# EAGLE design 23128Adapter_v1.0 (EAGLE 7.6.0)
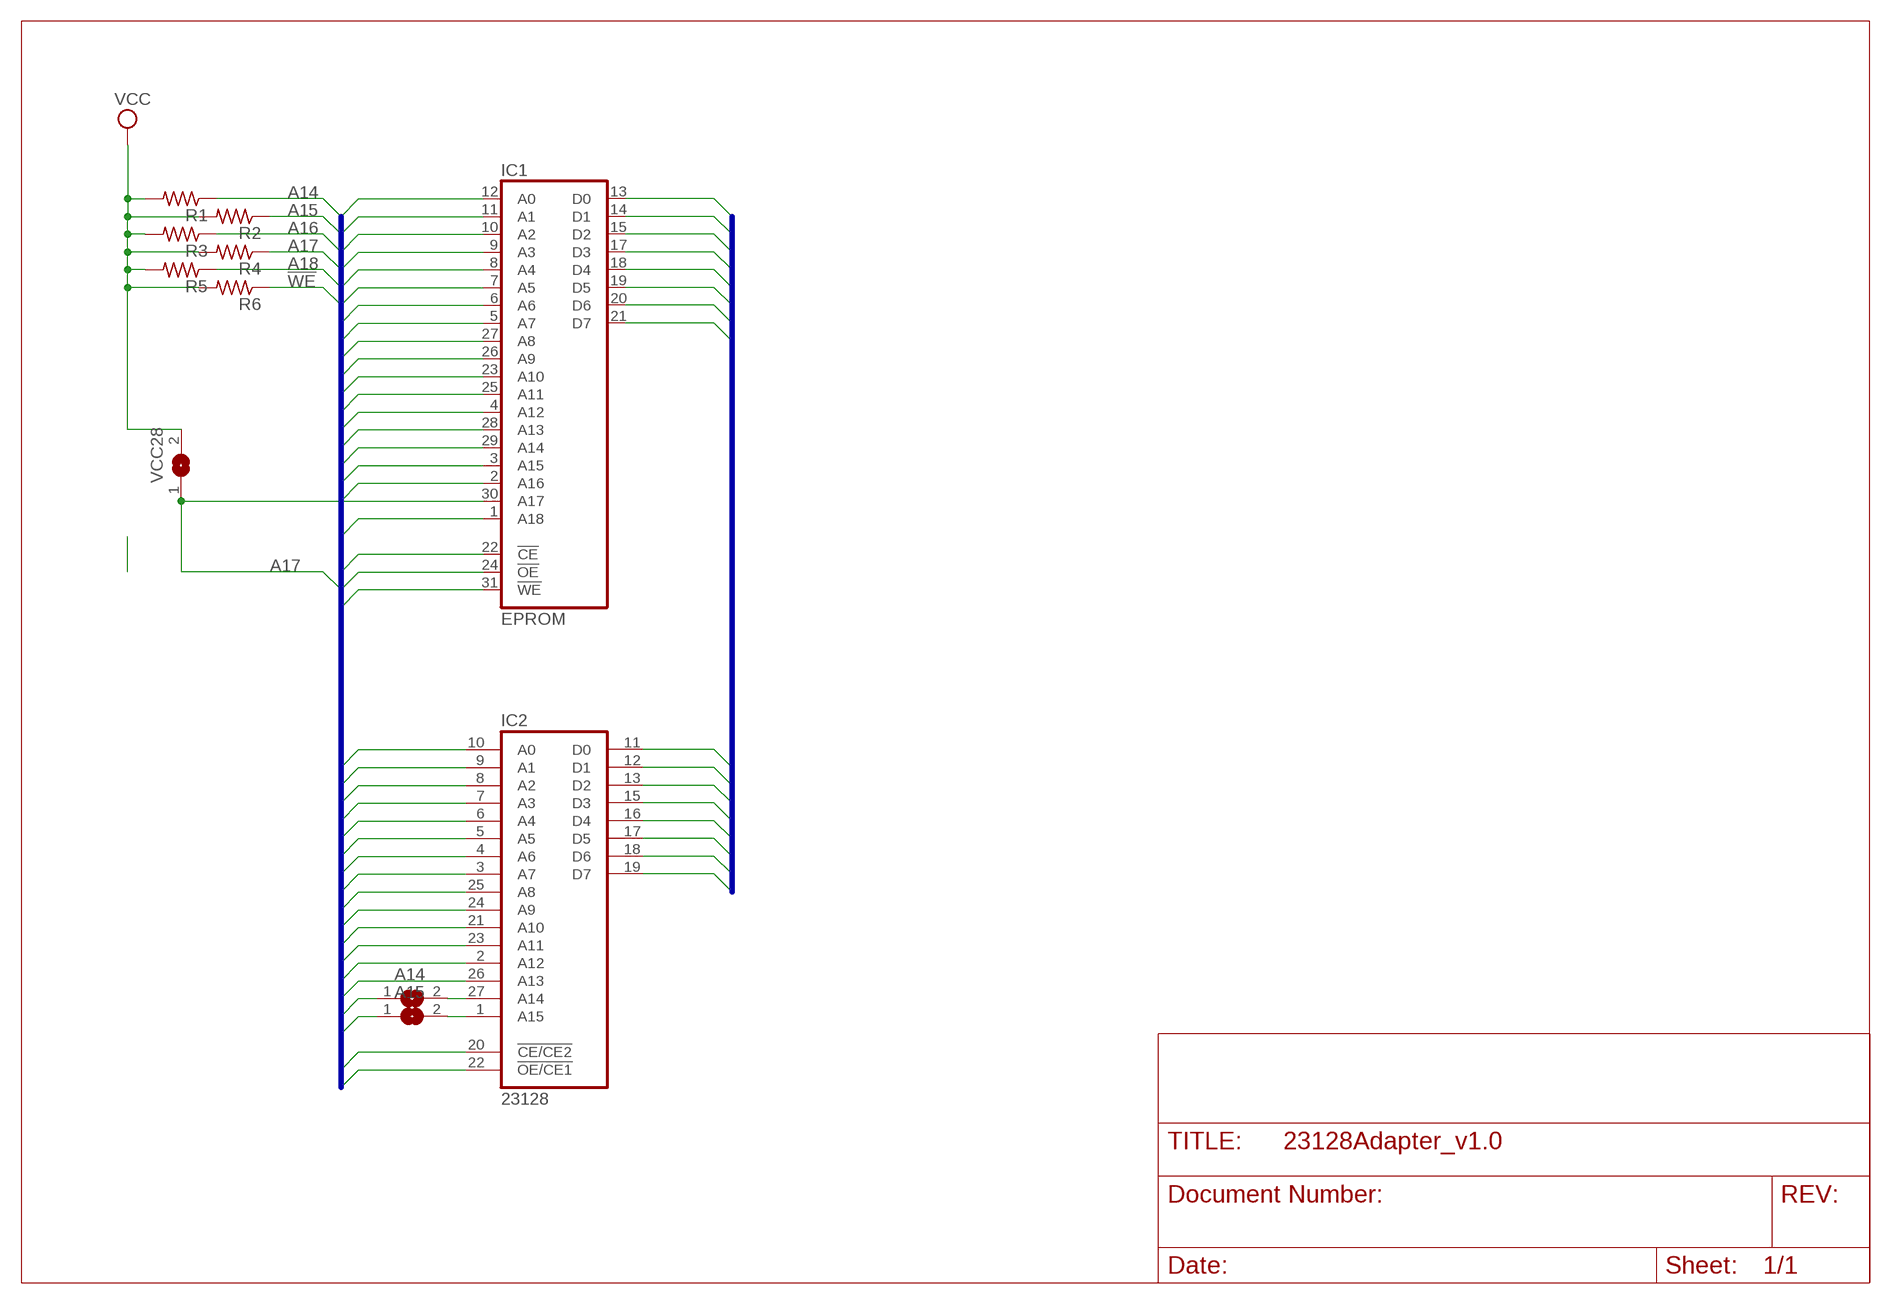
[diagram p0: schematic, sheet 1]

## Parts
A14  SJ  [SJ]
A15  SJ  [SJ]
IC1  EPROM  AM29F040RP  [DIL32-6ROUNDPAD]
IC2  23128  23512-RP  [DIL28-ROUNDPAD]
R1  R-US_0204/5  [0204/5]
R2  R-US_0204/5  [0204/5]
R3  R-US_0204/5  [0204/5]
R4  R-US_0204/5  [0204/5]
R5  R-US_0204/5  [0204/5]
R6  R-US_0204/5  [0204/5]
VCC28  SJ  [SJ]

## Nets
!CE: IC1.22(!CE) IC2.20(!CE/CE2)
!OE: IC1.24(!OE) IC2.22(!OE/CE1)
!WE: IC1.31(!WE) R6.1
A0: IC1.12(A0) IC2.10(A0)
A1: IC1.11(A1) IC2.9(A1)
A2: IC1.10(A2) IC2.8(A2)
A3: IC1.9(A3) IC2.7(A3)
A4: IC1.8(A4) IC2.6(A4)
A5: IC1.7(A5) IC2.5(A5)
A6: IC1.6(A6) IC2.4(A6)
A7: IC1.5(A7) IC2.3(A7)
A8: IC1.27(A8) IC2.25(A8)
A9: IC1.26(A9) IC2.24(A9)
A10: IC1.23(A10) IC2.21(A10)
A11: IC1.25(A11) IC2.23(A11)
A12: IC1.4(A12) IC2.2(A12)
A13: IC1.28(A13) IC2.26(A13)
A14: A14.1 IC1.29(A14) R1.1
A15: A15.1 IC1.3(A15) R2.1
A16: IC1.2(A16) R3.1
A17: IC1.30(A17) R4.1 VCC28.1
A18: IC1.1(A18) R5.1
D0: IC1.13(D0) IC2.11(D0)
D1: IC1.14(D1) IC2.12(D1)
D2: IC1.15(D2) IC2.13(D2)
D3: IC1.17(D3) IC2.15(D3)
D4: IC1.18(D4) IC2.16(D4)
D5: IC1.19(D5) IC2.17(D5)
D6: IC1.20(D6) IC2.18(D6)
D7: IC1.21(D7) IC2.19(D7)
N$1: A14.2 IC2.27(A14)
N$2: A15.2 IC2.1(A15)
VCC: R1.2 R2.2 R3.2 R4.2 R5.2 R6.2 VCC28.2

## Buses
A[0..18],!WE,!OE,!CE
D[0..7]

## Power pins joined to a net without a drawn wire
GND: IC1.16(GND) IC2.14(GND)
VCC: IC1.32(VCC) IC2.28(VCC)

## Library data of the parts
A14 A15 VCC28 = jumper:SJ: SMD solder JUMPER
IC1 = 0RB_Memory:AM29F040: 4-Megabit FLASH MEMORY (512 K x 8 bit) 5 V-only
IC2 = commodore:23512: MEMORY
R1-R6 = resistor:R-US_: RESISTOR, American symbol

## Board
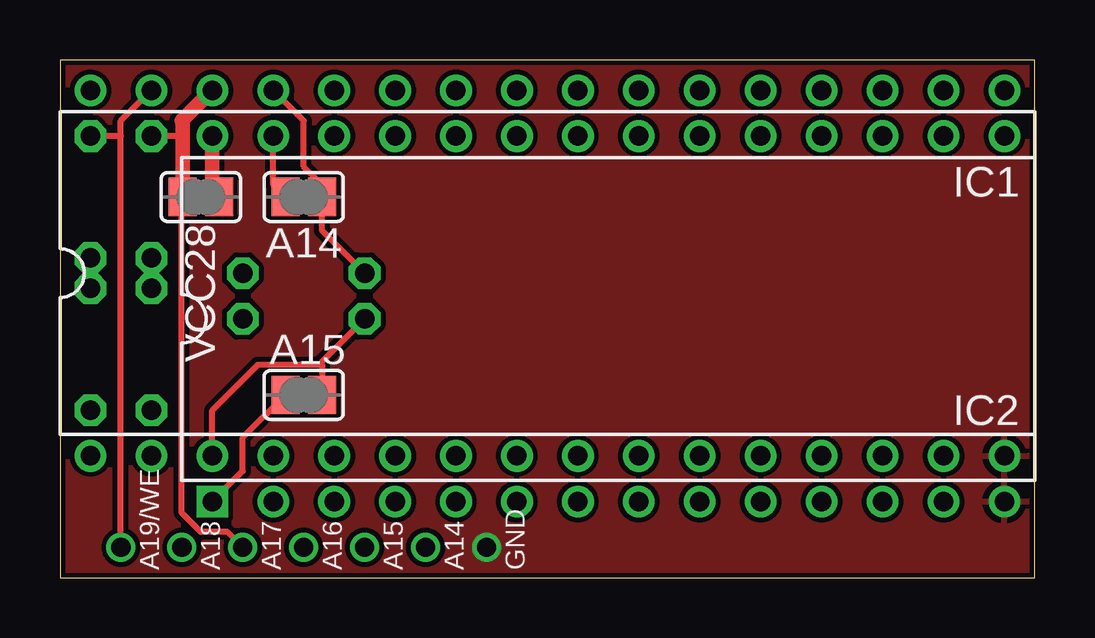
[diagram p1: board, top side]
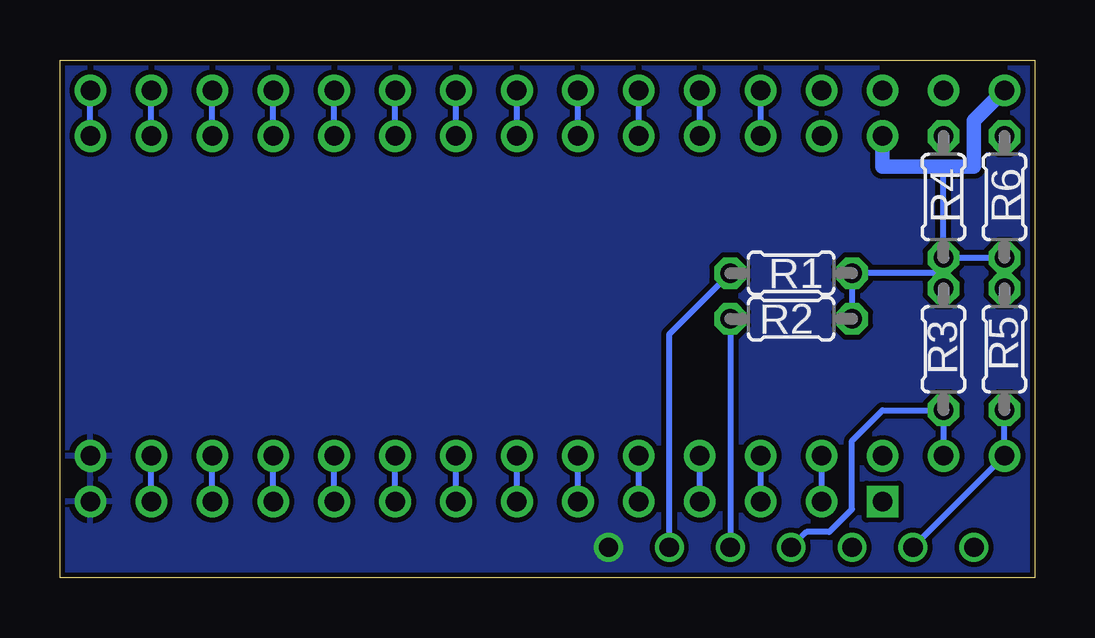
[diagram p2: board, bottom side, seen from below]

Size 40.64 x 21.59 mm. Coordinates in mm from the lower left corner, seen from the top.
Outline: 40.64,0 40.64,21.59 0,21.59 0.01,0 40.64,0
Copper layers (1*16): Top 0.035mm / dielectric 1.5mm / Bottom 0.035mm
Design rules "default *": minimum track width 10mil, minimum drill 24mil, track to track 8mil, track to pad 8mil, pad to pad 8mil, via to via 8mil, smd to smd 8mil, copper to edge 8mil, drill to drill 8mil, minimum pad ring 10mil, minimum via ring 8mil, stop-mask expansion 4mil, vias tented up to drill 0mil, thermal gap 10mil

### Footprints (pad centres in the part's own frame; a part is rotated, then mirrored left to right if it is on the bottom)
SJ = smd 1.168 x 1.6: 1 -0.762,0; 2 0.762,0
DIL32-6ROUNDPAD = drill 0.813: 1 -19.05,-7.62; 2 -16.51,-7.62; 3 -13.97,-7.62; 4 -11.43,-7.62; 5 -8.89,-7.62; 6 -6.35,-7.62; 7 -3.81,-7.62; 8 -1.27,-7.62; 9 1.27,-7.62; 10 3.81,-7.62; 11 6.35,-7.62; 12 8.89,-7.62; 13 11.43,-7.62; 14 13.97,-7.62; 15 16.51,-7.62; 16 19.05,-7.62; 17 19.05,7.62; 18 16.51,7.62; 19 13.97,7.62; 20 11.43,7.62; 21 8.89,7.62; 22 6.35,7.62; 23 3.81,7.62; 24 1.27,7.62; 25 -1.27,7.62; 26 -3.81,7.62; 27 -6.35,7.62; 28 -8.89,7.62; 29 -11.43,7.62; 30 -13.97,7.62; 31 -16.51,7.62; 32 -19.05,7.62
DIL28-ROUNDPAD = drill 0.813 square: 1 -16.51,-7.62 | drill 0.813: 2 -13.97,-7.62; 3 -11.43,-7.62; 4 -8.89,-7.62; 5 -6.35,-7.62; 6 -3.81,-7.62; 7 -1.27,-7.62; 8 1.27,-7.62; 9 3.81,-7.62; 10 6.35,-7.62; 11 8.89,-7.62; 12 11.43,-7.62; 13 13.97,-7.62; 14 16.51,-7.62; 15 16.51,7.62; 16 13.97,7.62; 17 11.43,7.62; 18 8.89,7.62; 19 6.35,7.62; 20 3.81,7.62; 21 1.27,7.62; 22 -1.27,7.62; 23 -3.81,7.62; 24 -6.35,7.62; 25 -8.89,7.62; 26 -11.43,7.62; 27 -13.97,7.62; 28 -16.51,7.62
0204/5 = drill 0.813 octagon: 1 -2.54,0; 2 2.54,0

### Placement (x,y rotation side)
A14  10.16,15.88 180 top
A15  10.16,7.62 180 top
IC1  20.32,12.7 0 top
IC2  22.86,10.79 0 top
R1  10.16,12.7 0 bottom
R2  10.16,10.79 0 bottom
R3  3.81,9.53 90 bottom
R4  3.81,15.88 270 bottom
R5  1.27,9.53 90 bottom
R6  1.27,15.88 270 bottom
VCC28  5.87,15.88 0 top

### Tracks (layer width: path | path; a pad name or v marks a point on that pad's centre or on a via)
!CE
  Bottom 0.254: IC2.20 IC1.22
!OE
  Bottom 0.254: IC2.22 IC1.24
!WE  (via drill 0.8)
  Top 0.254: IC1.31 2.54,19.05 2.54,18.41 | v2.54,1.27 2.54,18.41 | 2.54,18.41 R6.1
A0
  Bottom 0.254: IC2.10 IC1.12
A1
  Bottom 0.254: IC2.9 IC1.11
A2
  Bottom 0.254: IC2.8 IC1.10
A3
  Bottom 0.254: IC2.7 IC1.9
A4
  Bottom 0.254: IC2.6 IC1.8
A5
  Bottom 0.254: IC2.5 IC1.7
A6
  Bottom 0.254: IC2.4 IC1.6
A7
  Bottom 0.254: IC2.3 IC1.5
A8
  Bottom 0.254: IC2.25 IC1.27
A9
  Bottom 0.254: IC2.24 IC1.26
A10
  Bottom 0.254: IC2.21 IC1.23
A11
  Bottom 0.254: IC2.23 IC1.25
A12
  Bottom 0.254: IC2.2 IC1.4
A13
  Bottom 0.254: IC2.26 IC1.28
A14  (via drill 0.8)
  Top 0.254: IC1.29 10.16,19.05 10.16,17.14 10.8,16.51 10.8,16 A14.1 10.92,14.48 R1.1
  Bottom 0.254: v15.24,1.27 15.24,10.16 R1.1
A15  (via drill 0.8)
  Top 0.254: R2.1 10.92,9.02 10.92,8.89 | 10.92,8.89 A15.1 | IC1.3 6.35,6.99 8.26,8.89 10.92,8.89
  Bottom 0.254: R2.1 v12.7,1.27
A16  (via drill 0.8)
  Bottom 0.254: IC1.2 R3.1 6.35,6.99 7.62,5.71 7.62,2.86 8.57,1.91 9.53,1.91 v10.16,1.27
A17  (via drill 0.8)
  Top 0.254: v7.62,1.27 6.99,1.91 5.87,1.91 5.08,2.7 5.08,15.88 VCC28.1 | 5.11,18.41 R4.1
  Top 0.61: IC1.30 5.08,19.05 5.11,19.02 5.11,18.41 VCC28.1
A18  (via drill 0.8)
  Bottom 0.254: R5.1 IC1.1 v5.08,1.27
D0
  Bottom 0.254: IC2.11 IC1.13
D1
  Bottom 0.254: IC2.12 IC1.14
D2
  Bottom 0.254: IC2.13 IC1.15
D3
  Bottom 0.254: IC2.15 IC1.17
D4
  Bottom 0.254: IC2.16 IC1.18
D5
  Bottom 0.254: IC2.17 IC1.19
D6
  Bottom 0.254: IC2.18 IC1.20
D7
  Bottom 0.254: IC2.19 IC1.21
GND  (via drill 0.8)
  other vias: 17.78,1.27
  pour Top: 0,0 0,21.59 40.64,21.59 40.64,0
  pour Bottom: 0,0 0,21.59 40.64,21.59 40.64,0
N$1
  Top 0.254: IC2.27 8.89,16.38 A14.2
N$2
  Top 0.254: IC2.1 7.62,4.45 7.62,5.84 A15.2
VCC
  Top 0.61: VCC28.2 6.35,16.16 IC2.28
  Bottom 0.254: R5.2 R6.2 R4.2 | R4.2 3.81,12.7 | 3.81,12.7 R3.2 | R2.2 R1.2 3.81,12.7 | R4.2 3.81,17.14
  Bottom 0.61: IC1.32 2.54,19.05 2.54,17.14 3.81,17.14 6.35,17.14 IC2.28

### Text on the board
tNames: A19/WE | A18 | A17 | A16 | A15 | A14 | GND
tValues: (c) 2014 RETRO Innovations | www.go4retro.com